# Altium project PIL.PrjPcb
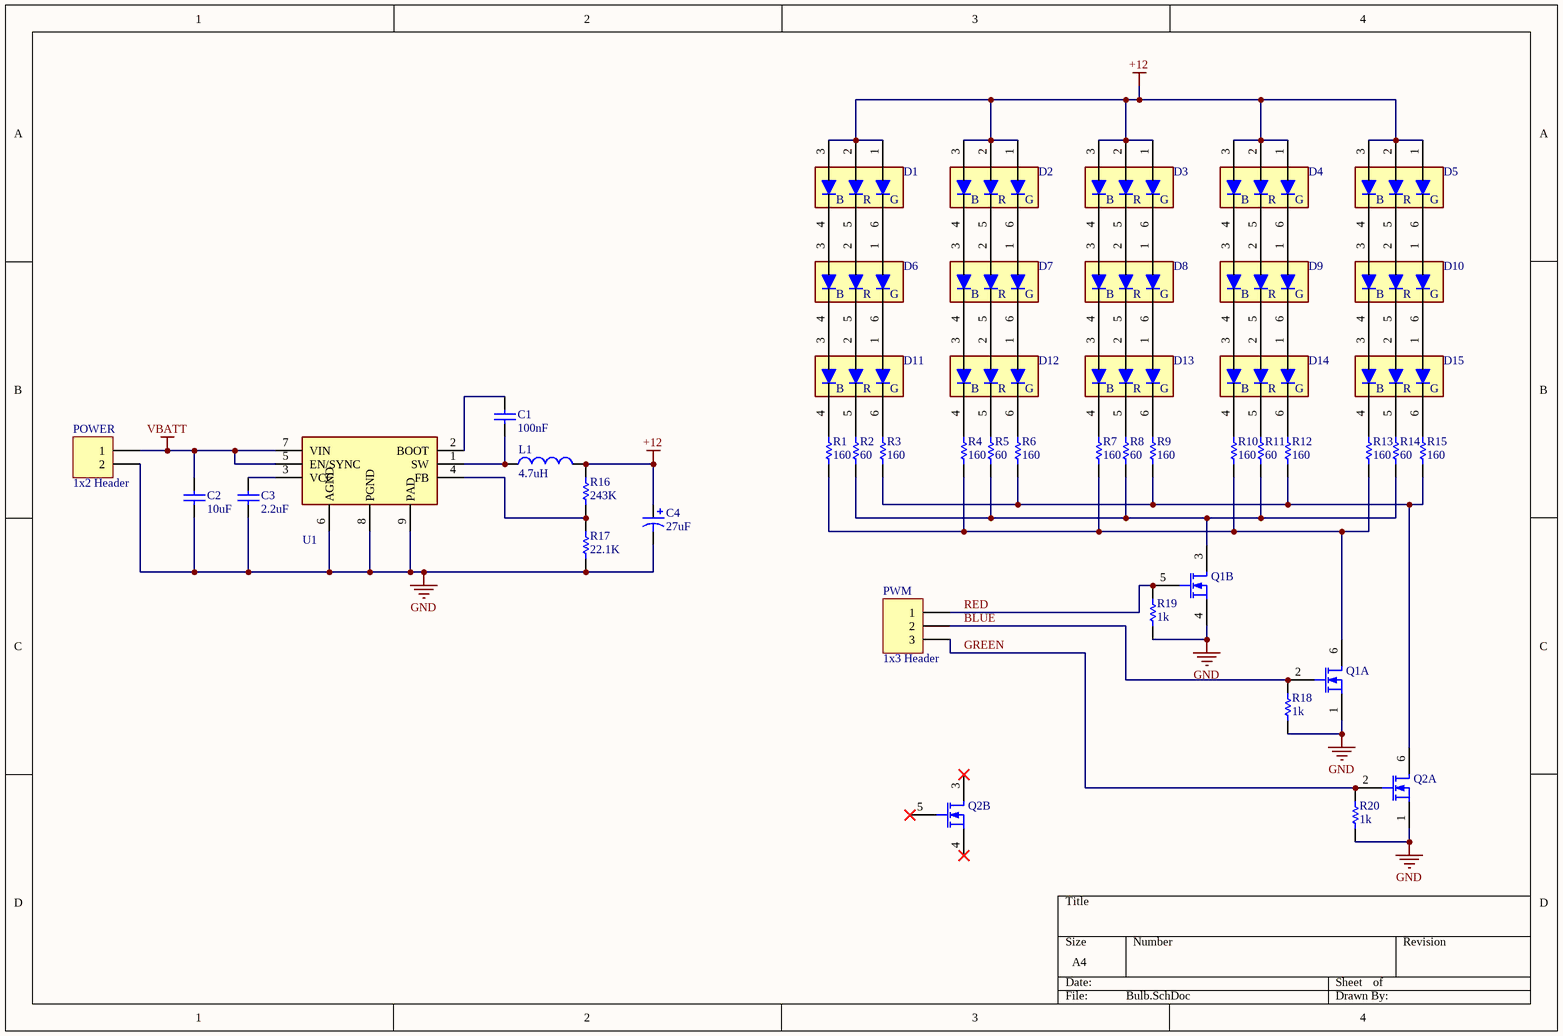
[diagram p0: Bulb.SchDoc]
1 sheet, 45 parts. Net scope: global (net labels, ports and power ports of the same name join across sheets).
Board file: PCB1.PcbDoc

## Sheet Bulb.SchDoc
size A4; SheetNumber: 1; SheetTotal: 1

### Parts
C1  value 100nF  [0603 - Capacitor]  (hidden comment: Capacitor - Nonpolarized)
C2  value 10uF  [0603 - Capacitor]  (hidden comment: Capacitor - Nonpolarized)
C3  value 2.2uF  [0603 - Capacitor]  (hidden comment: Capacitor - Nonpolarized)
C4  value 27uF  [OCVZ0606 - CAPACITOR]  (hidden comment: Capacitor - Polarized)
D1  RGB LED- Indiv  [RGB-6]  (value not drawn)
D2  RGB LED- Indiv  [RGB-6]  (value not drawn)
D3  RGB LED- Indiv  [RGB-6]  (value not drawn)
D4  RGB LED- Indiv  [RGB-6]  (value not drawn)
D5  RGB LED- Indiv  [RGB-6]  (value not drawn)
D6  RGB LED- Indiv  [RGB-6]  (value not drawn)
D7  RGB LED- Indiv  [RGB-6]  (value not drawn)
D8  RGB LED- Indiv  [RGB-6]  (value not drawn)
D9  RGB LED- Indiv  [RGB-6]  (value not drawn)
D10  RGB LED- Indiv  [RGB-6]  (value not drawn)
D11  RGB LED- Indiv  [RGB-6]  (value not drawn)
D12  RGB LED- Indiv  [RGB-6]  (value not drawn)
D13  RGB LED- Indiv  [RGB-6]  (value not drawn)
D14  RGB LED- Indiv  [RGB-6]  (value not drawn)
D15  RGB LED- Indiv  [RGB-6]  (value not drawn)
L1  value 4.7uH  [PA4340 - Inductor]  (hidden comment: Inductor)
POWER  1x2 Header  [B2B-XH]
PWM  1x3 Header  [B3B-XH]
Q1  BSD235NH6327XTSA1  [BSD235NH6327XTSA1]  (value not drawn)  (parts A,B of 2)
Q2  BSD235NH6327XTSA1  [BSD235NH6327XTSA1]  (value not drawn)  (parts A,B of 2)
R1  value 160  [1206 - Resistor]  (hidden comment: Resistor)
R2  value 60  [0603 - Resistor]  (hidden comment: Resistor)
R3  value 160  [1206 - Resistor]  (hidden comment: Resistor)
R4  value 160  [1206 - Resistor]  (hidden comment: Resistor)
R5  value 60  [0603 - Resistor]  (hidden comment: Resistor)
R6  value 160  [1206 - Resistor]  (hidden comment: Resistor)
R7  value 160  [1206 - Resistor]  (hidden comment: Resistor)
R8  value 60  [0603 - Resistor]  (hidden comment: Resistor)
R9  value 160  [1206 - Resistor]  (hidden comment: Resistor)
R10  value 160  [1206 - Resistor]  (hidden comment: Resistor)
R11  value 60  [0603 - Resistor]  (hidden comment: Resistor)
R12  value 160  [1206 - Resistor]  (hidden comment: Resistor)
R13  value 160  [1206 - Resistor]  (hidden comment: Resistor)
R14  value 60  [0603 - Resistor]  (hidden comment: Resistor)
R15  value 160  [1206 - Resistor]  (hidden comment: Resistor)
R16  value 243K  [0603 - Resistor]  (hidden comment: Resistor)
R17  value 22.1K  [0603 - Resistor]  (hidden comment: Resistor)
R18  value 1k  [1206 - Resistor]  (hidden comment: Resistor)
R19  value 1k  [1206 - Resistor]  (hidden comment: Resistor)
R20  value 1k  [1206 - Resistor]  (hidden comment: Resistor)
U1  LMR23625CDDAR  [LMR23625CDDAR]  (value not drawn)

### Nets
+12: C4.1 D1.1 D1.2 D1.3 D2.1 D2.2 D2.3 D3.1 D3.2 D3.3 D4.1 D4.2 D4.3 D5.1 D5.2 D5.3 L1.2 R16.2
GND: C2.1 C3.1 C4.2 POWER.2 Q1.1(S) Q1.4(S) Q2.1(S) R17.1 R18.1 R19.1 R20.1 U1.6(AGND) U1.8(PGND) U1.9(PAD)
VBATT: C2.2 POWER.1 U1.5(EN/SYNC) U1.7(VIN)
BLUE: PWM.2 Q1.2(G) R18.2
GREEN: PWM.3 Q2.2(G) R20.2
RED: PWM.1 Q1.5(G) R19.2
NetC1_1: C1.1 L1.1 U1.1(SW)
NetC1_2: C1.2 U1.2(BOOT)
NetC3_2: C3.2 U1.3(VCC)
NetD1_4: D1.4 D6.3
NetD1_5: D1.5 D6.2
NetD1_6: D1.6 D6.1
NetD2_4: D2.4 D7.3
NetD2_5: D2.5 D7.2
NetD2_6: D2.6 D7.1
NetD3_4: D3.4 D8.3
NetD3_5: D3.5 D8.2
NetD3_6: D3.6 D8.1
NetD4_4: D4.4 D9.3
NetD4_5: D4.5 D9.2
NetD4_6: D4.6 D9.1
NetD5_4: D5.4 D10.3
NetD5_5: D5.5 D10.2
NetD5_6: D5.6 D10.1
NetD6_4: D6.4 D11.3
NetD6_5: D6.5 D11.2
NetD6_6: D6.6 D11.1
NetD7_4: D7.4 D12.3
NetD7_5: D7.5 D12.2
NetD7_6: D7.6 D12.1
NetD8_4: D8.4 D13.3
NetD8_5: D8.5 D13.2
NetD8_6: D8.6 D13.1
NetD9_4: D9.4 D14.3
NetD9_5: D9.5 D14.2
NetD9_6: D9.6 D14.1
NetD10_4: D10.4 D15.3
NetD10_5: D10.5 D15.2
NetD10_6: D10.6 D15.1
NetD11_4: D11.4 R1.2
NetD11_5: D11.5 R2.2
NetD11_6: D11.6 R3.2
NetD12_4: D12.4 R4.2
NetD12_5: D12.5 R5.2
NetD12_6: D12.6 R6.2
NetD13_4: D13.4 R7.2
NetD13_5: D13.5 R8.2
NetD13_6: D13.6 R9.2
NetD14_4: D14.4 R10.2
NetD14_5: D14.5 R11.2
NetD14_6: D14.6 R12.2
NetD15_4: D15.4 R13.2
NetD15_5: D15.5 R14.2
NetD15_6: D15.6 R15.2
NetQ1_3: Q1.3(D) R2.1 R5.1 R8.1 R11.1 R14.1
NetQ1_6: Q1.6(D) R1.1 R4.1 R7.1 R10.1 R13.1
NetQ2_6: Q2.6(D) R3.1 R6.1 R9.1 R12.1 R15.1
NetR16_1: R16.1 R17.2 U1.4(FB)

Not connected (* = marked no-connect by the designer): Q2 3(D)* 4(S)* 5(G)*

### Notes on the sheet
- (in symbol RGB LED- Indiv) B; R; G

### Library data of the parts
C1 = Capacitor - Nonpolarized: Nonpolarized Capacitor; Manufacturer: Murata; Manufacturer Part Number: GRM155R71C104KA88D; Supplier Part Number: 490-3261-1-ND; Supplier: Digikey; Rating: *
C2 = Capacitor - Nonpolarized: Nonpolarized Capacitor; Manufacturer: TDK; Manufacturer Part Number: C3225X7R1H106M250AC; Supplier Part Number: 445-14933-1-ND; Supplier: Digikey; Rating: *
C3 = Capacitor - Nonpolarized: Nonpolarized Capacitor; Manufacturer: Kemet; Manufacturer Part Number: C0603C225K8PACTU; Supplier Part Number: 399-4911-1-ND; Supplier: Digikey; Rating: *
C4 = Capacitor - Polarized: Polarized Capacitor; Manufacturer: Panasonic Electronic Components; Manufacturer Part Number: EEE-FK1E270SR; Supplier: Digikey; Supplier Part Number: PCE5152CT-ND; Rating: *
D1-D15 = RGB LED- Indiv: 6-pin RGB LED; Manufacturer Part Number: HL-AF-5060H271BU46FU79GC-S1-THL; Manufacturer: Hongli Zhihui (HONGLITRONIC); Supplier Part Number: C219409; Supplier: JLCPCB
L1 = Inductor: Manufacturer Part Number: 7447706047; Manufacturer: Würth Elektronik; Rating: *; Supplier Part Number: 732-7447706047CT-ND; Supplier: Digikey
POWER = 1x2 Header: 1x2 Pin Header
PWM = 1x3 Header: 1x3 Pin Header
Q1 Q2 = BSD235NH6327XTSA1: Manufacturer: Infineon; Supplier Part Number: BSD235NH6327XTSA1CT-ND; Supplier: Digikey; Manufacturer Part Number: BSD235NH6327XTSA1
R1 R3 R4 R6 R7 R9 R10 R12 R13 R15 = Resistor: Manufacturer Part Number: ESR18EZPJ161; Manufacturer: Yageo; Rating: *; Supplier Part Number: RHM160ICT-ND; Supplier: Digikey
R2 R5 R8 R11 R14 = Resistor: Manufacturer Part Number: RC0603FR-0759RL; Manufacturer: Yageo; Rating: *; Supplier Part Number: 311-59.0HRCT-ND; Supplier: Digikey
R16 = Resistor: Manufacturer Part Number: RC0603FR-07243RL; Manufacturer: Yageo; Rating: *; Supplier Part Number: 311-243HRCT-ND; Supplier: Digikey
R17 = Resistor: Manufacturer Part Number: RC0603FR-0722RL; Manufacturer: Yageo; Rating: *; Supplier Part Number: 311-22.0HRCT-ND; Supplier: Digikey
R18-R20 = Resistor: Manufacturer Part Number: RC0603FR-071KL; Manufacturer: Yageo; Rating: *; Supplier Part Number: 311-1.00KHRCT-ND; Supplier: Digikey
U1 = LMR23625CDDAR: 36V 2.5A Buck Converter; Manufacturer: TI; Manufacturer Part Number: LMR23625CDDAR; Supplier Part Number: 296-47268-1-ND; Supplier: Digikey; ComponentLink1Description: Datasheet; ComponentLink1URL: https://www.ti.com/lit/ds/symlink/lmr23625.pdf?HQS=dis-dk-null-digikeymode-dsf-pf-null-wwe&ts=1623367278580